# EAGLE design PICqueno32.v1a (EAGLE 5.11)
PROJECT: PICqueño32 v1.0
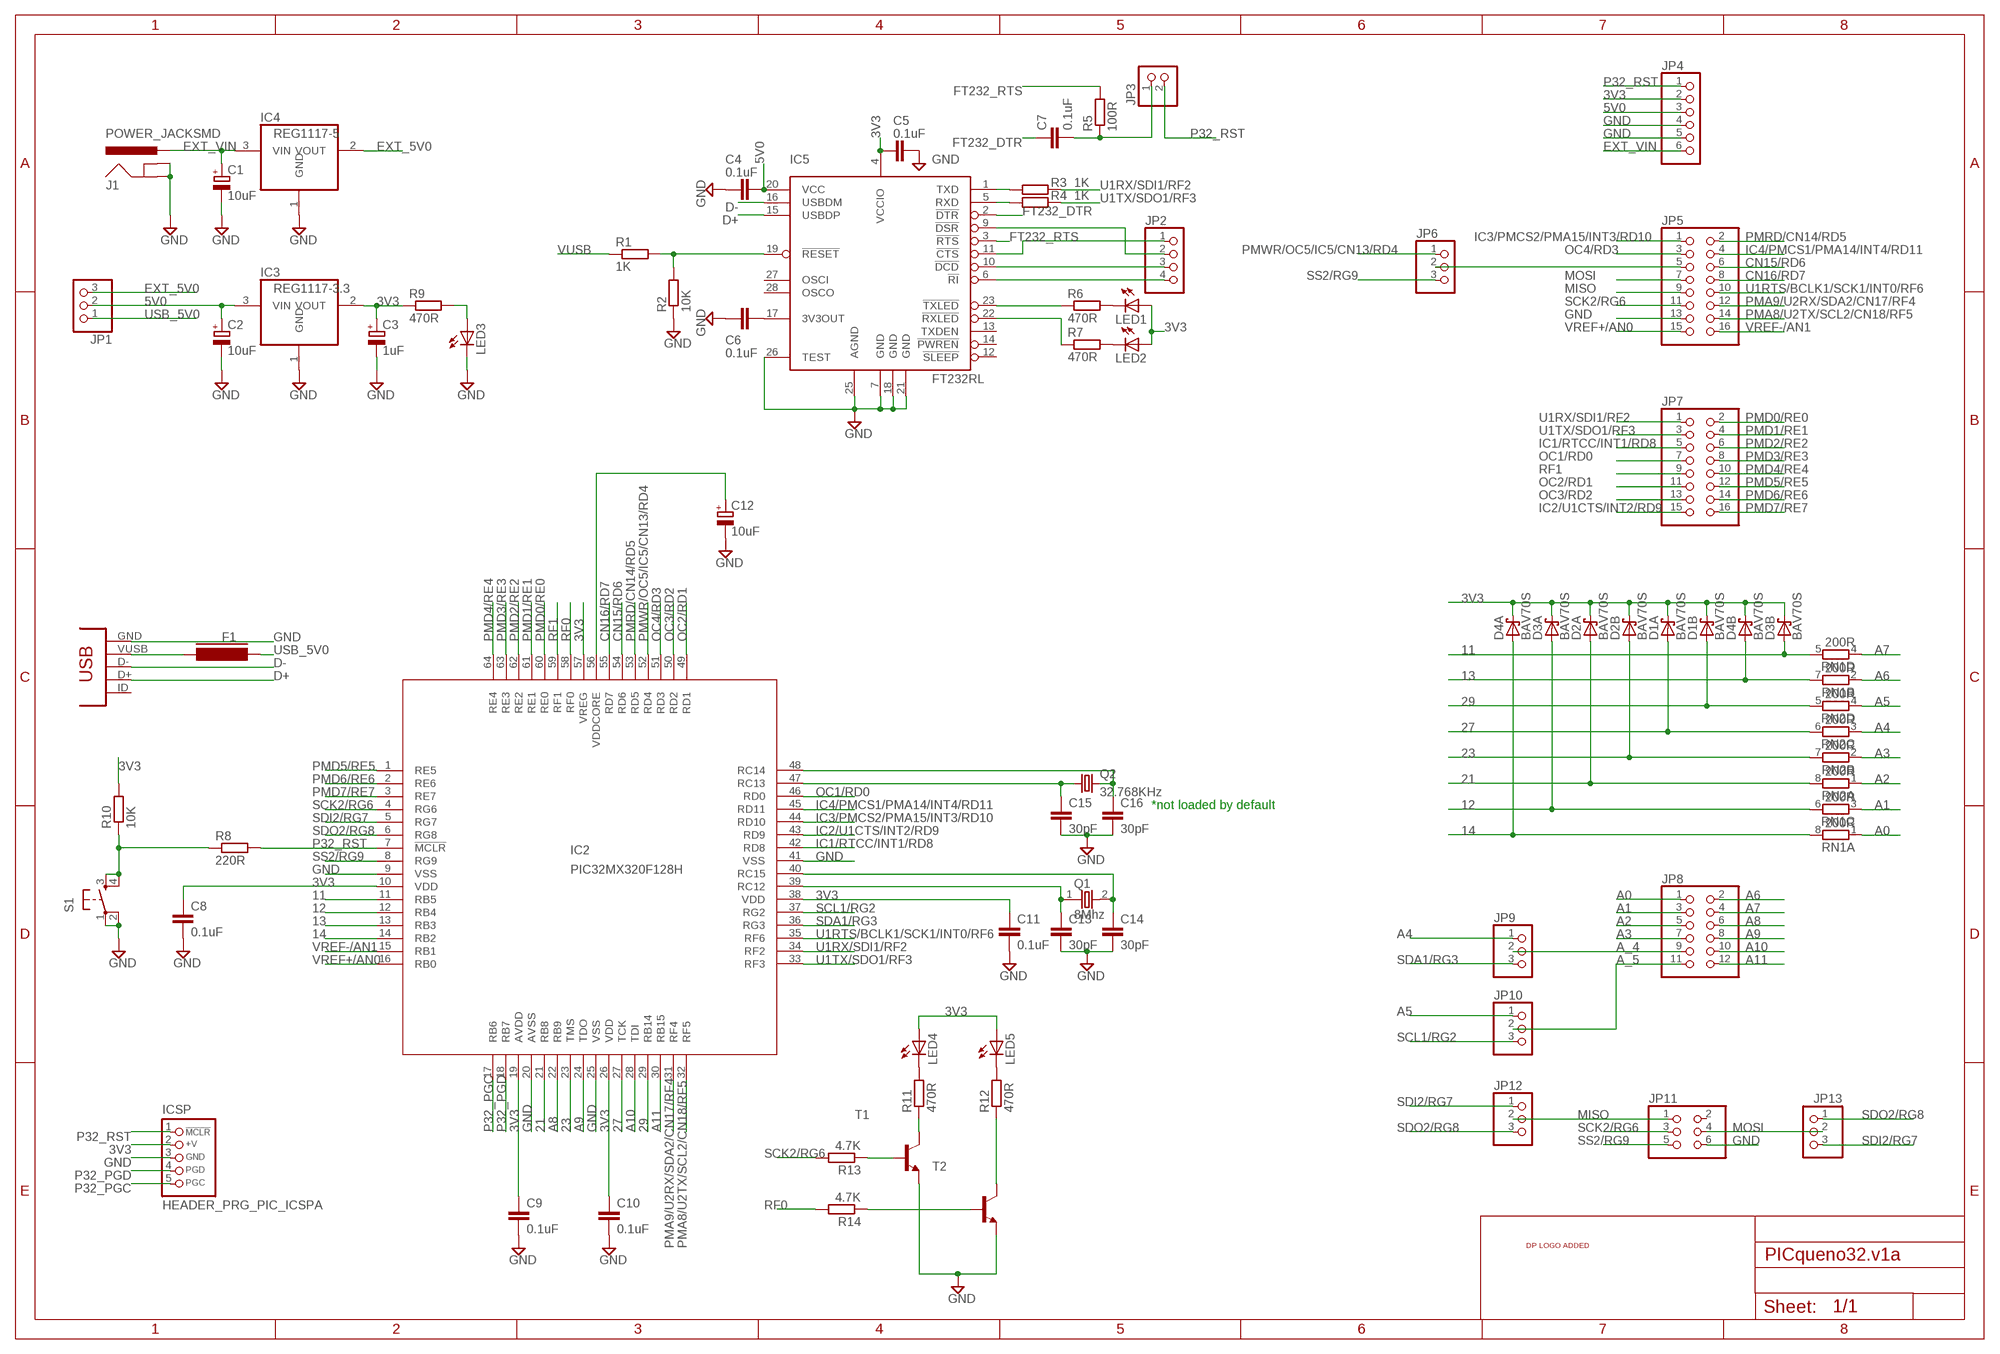
[diagram p0: schematic, sheet 1]

## Parts
C1  10uF  CAP_POLSMC_A  [SMC_A]
C2  10uF  CAP_POLSMC_A  [SMC_A]
C3  1uF  CAP_POLSMC_A  [SMC_A]
C4  0.1uF  CAPC603  [C603]
C5  0.1uF  CAPC603  [C603]
C6  0.1uF  CAPC603  [C603]
C7  0.1uF  CAPC603  [C603]
C8  0.1uF  CAPC603  [C603]
C9  0.1uF  CAPC603  [C603]
C10  0.1uF  CAPC603  [C603]
C11  0.1uF  CAPC603  [C603]
C12  10uF  CAP_POLSMC_A  [SMC_A]
C13  30pF  CAPC603  [C603]
C14  30pF  CAPC603  [C603]
C15  30pF  CAPC603  [C603]
C16  30pF  CAPC603  [C603]
D1  BAV70S  BAS70-07S  [SOT363_PHILIPS]
D2  BAV70S  BAS70-07S  [SOT363_PHILIPS]
D3  BAV70S  BAS70-07S  [SOT363_PHILIPS]
D4  BAV70S  BAS70-07S  [SOT363_PHILIPS]
F1  FERRITE_BEAD603  [FB603]
IC2  PIC32MX320F128H  PIC32MX320F064H  [TQFP64-10X10]
IC3  REG1117-3.3  REG1117  [SOT223]
IC4  REG1117-5  REG1117  [SOT223]
IC5  FT232RL  [SSOP28]
ICSP  HEADER_PRG_PIC_ICSPA  [HEADER_PRG_1X05]
J1  POWER_JACKSMD  [POWER_JACK_SMD]
JP1  PINHD-1X3  [1X03]
JP2  PINHD-1X4  [1X04]
JP3  PINHD-1X2  [1X02]
JP4  PINHD-1X6  [1X06]
JP5  PINHD-2X8  [2X08]
JP6  PINHD-1X3  [1X03]
JP7  PINHD-2X8  [2X08]
JP8  PINHD-2X6  [2X06]
JP9  PINHD-1X3  [1X03]
JP10  PINHD-1X3  [1X03]
JP11  PINHD-2X3  [2X03]
JP12  PINHD-1X3  [1X03]
JP13  PINHD-1X3  [1X03]
LED1  LED805  [LED-805]
LED2  LED805  [LED-805]
LED3  LED805  [LED-805]
LED4  LED805  [LED-805]
LED5  LED805  [LED-805]
Q1  8Mhz  OSC-XTAL  [HC-49U]
Q2  32.768KHz  CRYSTALTC26H  [TC26H]
R1  1K  RESISTORR603  [R603]
R2  10K  RESISTORR603  [R603]
R3  1K  RESISTORR603  [R603]
R4  1K  RESISTORR603  [R603]
R5  100R  RESISTORR603  [R603]
R6  470R  RESISTORR603  [R603]
R7  470R  RESISTORR603  [R603]
R8  220R  RESISTORR603  [R603]
R9  470R  RESISTORR603  [R603]
R10  10K  RESISTORR603  [R603]
R11  470R  RESISTORR603  [R603]
R12  470R  RESISTORR603  [R603]
R13  4.7K  RESISTORR603  [R603]
R14  4.7K  RESISTORR603  [R603]
RN1  200R  RNETWORK  [RN8P-4R-CRA06S]
RN2  200R  RNETWORK  [RN8P-4R-CRA06S]
S1  SW-SMD-SMALL  [TACT_SWITCH_SMALL]
T1  BJT-NPNSOT23BEC  [SOT23-BEC]
T2  BJT-NPNSOT23BEC  [SOT23-BEC]
U$1  DP_LOGO  [DP_LOGO]
USB1  CON-USB-MINI-BUSB1  [CONN_USB_MINI-B]

## Nets
3V3: C3.+ C5.1 C8.1 C9.1 C10.1 C11.1 D1.3(B:C) D1.6(A:C) D2.3(B:C) D2.6(A:C) D3.3(B:C) D3.6(A:C) D4.3(B:C) D4.6(A:C) IC2.10(VDD) IC2.19(AVDD) IC2.26(VDD) IC2.38(VDD) IC2.57(VREG) IC3.2(VOUT) IC5.4(VCCIO) ICSP.2(+V) JP4.2 LED1.A LED2.A LED4.A LED5.A R9.1 R10.2
5V0: C2.+ C4.1 IC3.3(VIN) IC5.20(VCC) JP1.2 JP4.3
11: D3.4(B:A) IC2.11(RB5) RN1.5
12: D3.1(A:A) IC2.12(RB4) RN1.6
13: D4.4(B:A) IC2.13(RB3) RN1.7
14: D4.1(A:A) IC2.14(RB2) RN1.8
21: D2.1(A:A) IC2.21(RB8) RN2.8
23: D2.4(B:A) IC2.23(TMS) RN2.7
27: D1.1(A:A) IC2.27(TCK) RN2.6
29: D1.4(B:A) IC2.29(RB14) RN2.5
A0: JP8.1 RN1.1
A1: JP8.3 RN1.3
A2: JP8.5 RN2.1
A3: JP8.7 RN2.2
A4: JP9.1 RN2.3
A5: JP10.1 RN2.4
A6: JP8.2 RN1.2
A7: JP8.4 RN1.4
A8: IC2.22(RB9) JP8.6
A9: IC2.24(TDO) JP8.8
A10: IC2.28(TDI) JP8.10
A11: IC2.30(RB15) JP8.12
A_4: JP8.9 JP9.2
A_5: JP8.11 JP10.2
CN15/RD6: IC2.54(RD6) JP5.6
CN16/RD7: IC2.55(RD7) JP5.8
CTS: IC5.11(!CTS) JP2.1
D+: IC5.15(USBDP) USB1.D+
D-: IC5.16(USBDM) USB1.D-
DCD: IC5.10(!DCD) JP2.3
DSR: IC5.9(!DSR) JP2.2
EXT_5V0: IC4.2(VOUT) JP1.3
EXT_VIN: C1.+ IC4.3(VIN) J1.VIN0(PWR) JP4.6
FT232_DTR: C7.1 IC5.2(!DTR)
FT232_RTS: IC5.3(!RTS) R5.2
GND: C1.- C2.- C3.- C4.2 C5.2 C6.2 C8.2 C9.2 C10.2 C11.2 C12.- C13.2 C14.2 C15.2 C16.2 IC2.9(VSS) IC2.20(AVSS) IC2.25(VSS) IC2.41(VSS) IC3.1(GND) IC4.1(GND) IC5.7(GND) IC5.18(GND) IC5.21(GND) IC5.25(AGND) IC5.26(TEST) ICSP.3(GND) J1.GND(GNDBREAK) J1.P$4(GND) JP4.4 JP4.5 JP5.13 JP11.6 LED3.C R2.1 S1.1 S1.2 T1.E T2.E USB1.GND
IC1/RTCC/INT1/RD8: IC2.42(RD8) JP7.5
IC2/U1CTS/INT2/RD9: IC2.43(RD9) JP7.15
IC3/PMCS2/PMA15/INT3/RD10: IC2.44(RD10) JP5.1
IC4/PMCS1/PMA14/INT4/RD11: IC2.45(RD11) JP5.4
MISO: JP5.9 JP11.1 JP12.2
MOSI: JP5.7 JP11.4 JP13.2
N$1: C6.1 IC5.17(3V3OUT)
N$2: IC5.19(!RESET) R1.2 R2.2
N$3: IC5.1(TXD) R3.1
N$4: IC5.5(RXD) R4.1
N$5: C12.+ IC2.56(VDDCORE)
N$6: LED1.C R6.2
N$7: C7.2 JP3.1 R5.1
N$8: JP5.5 JP6.2
N$11: LED2.C R7.2
N$12: IC5.23(!TXLED) R6.1
N$15: LED3.A R9.2
N$16: R8.1 R10.1 S1.3 S1.4
N$17: R11.1 T1.C
N$18: LED4.C R11.2
N$19: C13.1 IC2.39(RC12) Q1.1
N$20: C14.1 IC2.40(RC15) Q1.2
N$21: LED5.C R12.2
N$22: C15.1 IC2.47(RC13) Q2.1
N$23: C16.1 IC2.48(RC14) Q2.2
N$24: R12.1 T2.C
N$26: R13.1 T1.B
N$27: R14.1 T2.B
N$32: IC5.22(!RXLED) R7.1
OC1/RD0: IC2.46(RD0) JP7.7
OC2/RD1: IC2.49(RD1) JP7.11
OC3/RD2: IC2.50(RD2) JP7.13
OC4/RD3: IC2.51(RD3) JP5.3
P32_PGC: IC2.17(RB6) ICSP.5(PGC)
P32_PGD: IC2.18(RB7) ICSP.4(PGD)
P32_RST: IC2.7(!MCLR) ICSP.1(/MCLR) JP3.2 JP4.1 R8.2
PMA8/U2TX/SCL2/CN18/RF5: IC2.32(RF5) JP5.14
PMA9/U2RX/SDA2/CN17/RF4: IC2.31(RF4) JP5.12
PMD0/RE0: IC2.60(RE0) JP7.2
PMD1/RE1: IC2.61(RE1) JP7.4
PMD2/RE2: IC2.62(RE2) JP7.6
PMD3/RE3: IC2.63(RE3) JP7.8
PMD4/RE4: IC2.64(RE4) JP7.10
PMD5/RE5: IC2.1(RE5) JP7.12
PMD6/RE6: IC2.2(RE6) JP7.14
PMD7/RE7: IC2.3(RE7) JP7.16
PMRD/CN14/RD5: IC2.53(RD5) JP5.2
PMWR/OC5/IC5/CN13/RD4: IC2.52(RD4) JP6.1
RF0: IC2.58(RF0) R14.2
RF1: IC2.59(RF1) JP7.9
RI: IC5.6(!RI) JP2.4
SCK2/RG6: IC2.4(RG6) JP5.11 JP11.3 R13.2
SCL1/RG2: IC2.37(RG2) JP10.3
SDA1/RG3: IC2.36(RG3) JP9.3
SDI2/RG7: IC2.5(RG7) JP12.1 JP13.3
SDO2/RG8: IC2.6(RG8) JP12.3 JP13.1
SS2/RG9: IC2.8(RG9) JP6.3 JP11.5
U1RTS/BCLK1/SCK1/INT0/RF6: IC2.35(RF6) JP5.10
U1RX/SDI1/RF2: IC2.34(RF2) JP7.1 R3.2
U1TX/SDO1/RF3: IC2.33(RF3) JP7.3 R4.2
USB_5V0: F1.1 JP1.1
VREF+/AN0: IC2.16(RB0) JP5.15
VREF-/AN1: IC2.15(RB1) JP5.16
VUSB: F1.2 R1.1 USB1.VUSB
Unconnected: IC5.12(!SLEEP) IC5.13(TXDEN) IC5.14(!PWREN) IC5.27(OSCI) IC5.28(OSCO) JP11.2 USB1.BODY@1(BODY) USB1.BODY@2(BODY) USB1.BODY@3(BODY) USB1.BODY@4(BODY) USB1.ID(USBID)

## Notes on the sheet
- *not loaded by default

## Library data of the parts
C1-C3 C12 = dp_devices:CAP_POL
C4-C11 C13-C16 = dp_devices:CAP
D1-D4 = diode:BAS70-07: Silicon Schottky Diodes General-purpose diode for high-speed switching Source: BAS70_1PS7XSB70_SER_8.pdf
F1 = dp_devices:FERRITE_BEAD
IC2 = microchip:PIC32MX320F*H: PIC32MX320FxxxH Source: http://ww1.microchip.com/downloads/en/DeviceDoc/61143E.pdf, PIC32MX320F064H.bsdl; MPN: PIC32MX320F064H-80I/PT; OC_FARNELL: 1778934; OC_NEWARK: 77M3147
IC3 IC4 = burr-brown:REG1117: 800mA and 1A Low Dropout (LDO) Positive Regulator 1.8V, 2.5V, 2.85V, 3.3V, 5V, and Adj; MPN: REG1117; OC_FARNELL: 1097566; OC_NEWARK: 14P6981
IC5 = dp_devices:FT232RL: USB to serial UART interface
ICSP = dp_devices:HEADER_PRG_PIC_ICSP: 5-pin PIC In Circuit Serial Programming header
J1 = SparkFun:POWER_JACK: Power Jack This is the standard 5.5mm barrel jack for power. The PTH is the most common, proven, reliable, footprint. All others are experimental. The Slot footprint only works if the mill layer is transmitted to the PCB fab house so be warned. Spark Fun Electronics SKU : PRT-00119. Mating wall wart : TOL-00298 (and others)
JP1 JP6 JP9 JP10 JP12 JP13 = pinhead:PINHD-1X3: PIN HEADER
JP2 = pinhead:PINHD-1X4: PIN HEADER
JP3 = pinhead:PINHD-1X2: PIN HEADER
JP4 = pinhead:PINHD-1X6: PIN HEADER
JP5 JP7 = pinhead:PINHD-2X8: PIN HEADER
JP8 = pinhead:PINHD-2X6: PIN HEADER
JP11 = pinhead:PINHD-2X3: PIN HEADER
LED1-LED5 = dp_devices:LED
Q1 = dp_devices:OSC-XTAL
Q2 = crystal:CRYSTAL: CRYSTAL; OC_FARNELL: unknown; OC_NEWARK: unknown
R1-R14 = dp_devices:RESISTOR
RN1 RN2 = dp_devices:RNETWORK: 4 Resistor Array 0603
S1 = dp_devices:SW-SMD-SMALL
T1 T2 = dp_devices:BJT-NPN: Most commonly used is SOT23-BEC
U$1 = dp_devices:DP_LOGO; FF1: fullfillment by; FF2: Seeed studio; FF3: www.seeedstudio.com; LICENSE: CC-BY-SA; PROJECT: project; URL1: DangerousPrototypes.com; URL2: DangerousPrototypes.com
USB1 = dp_devices:CON-USB-MINI-B: USB connector

## Board
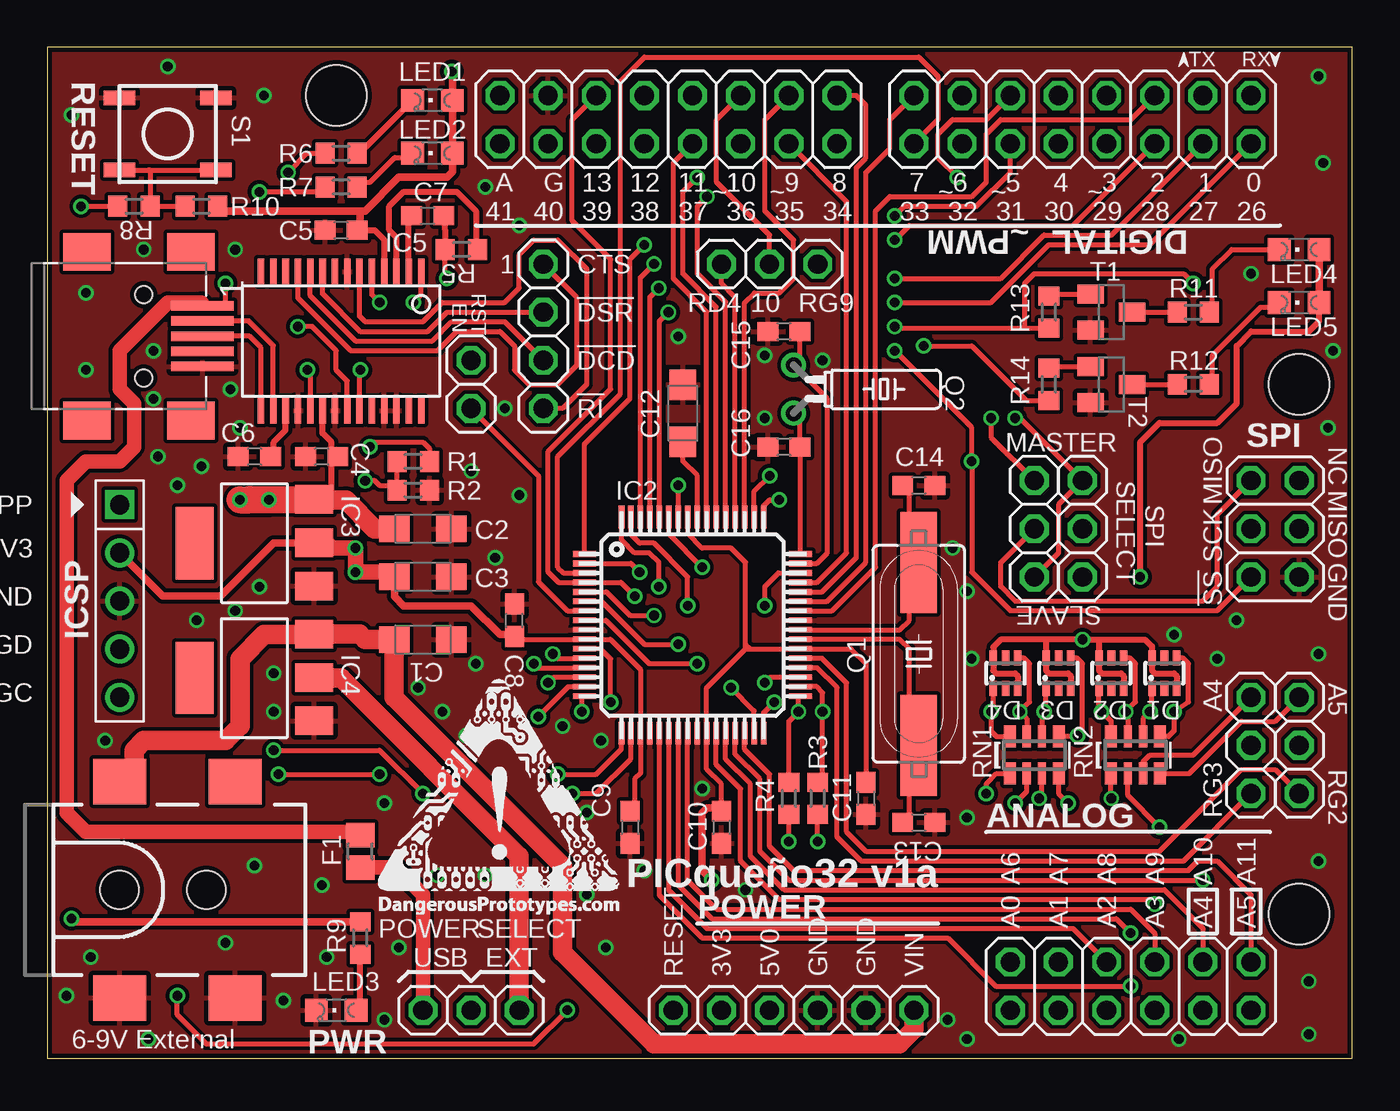
[diagram p1: board, top side]
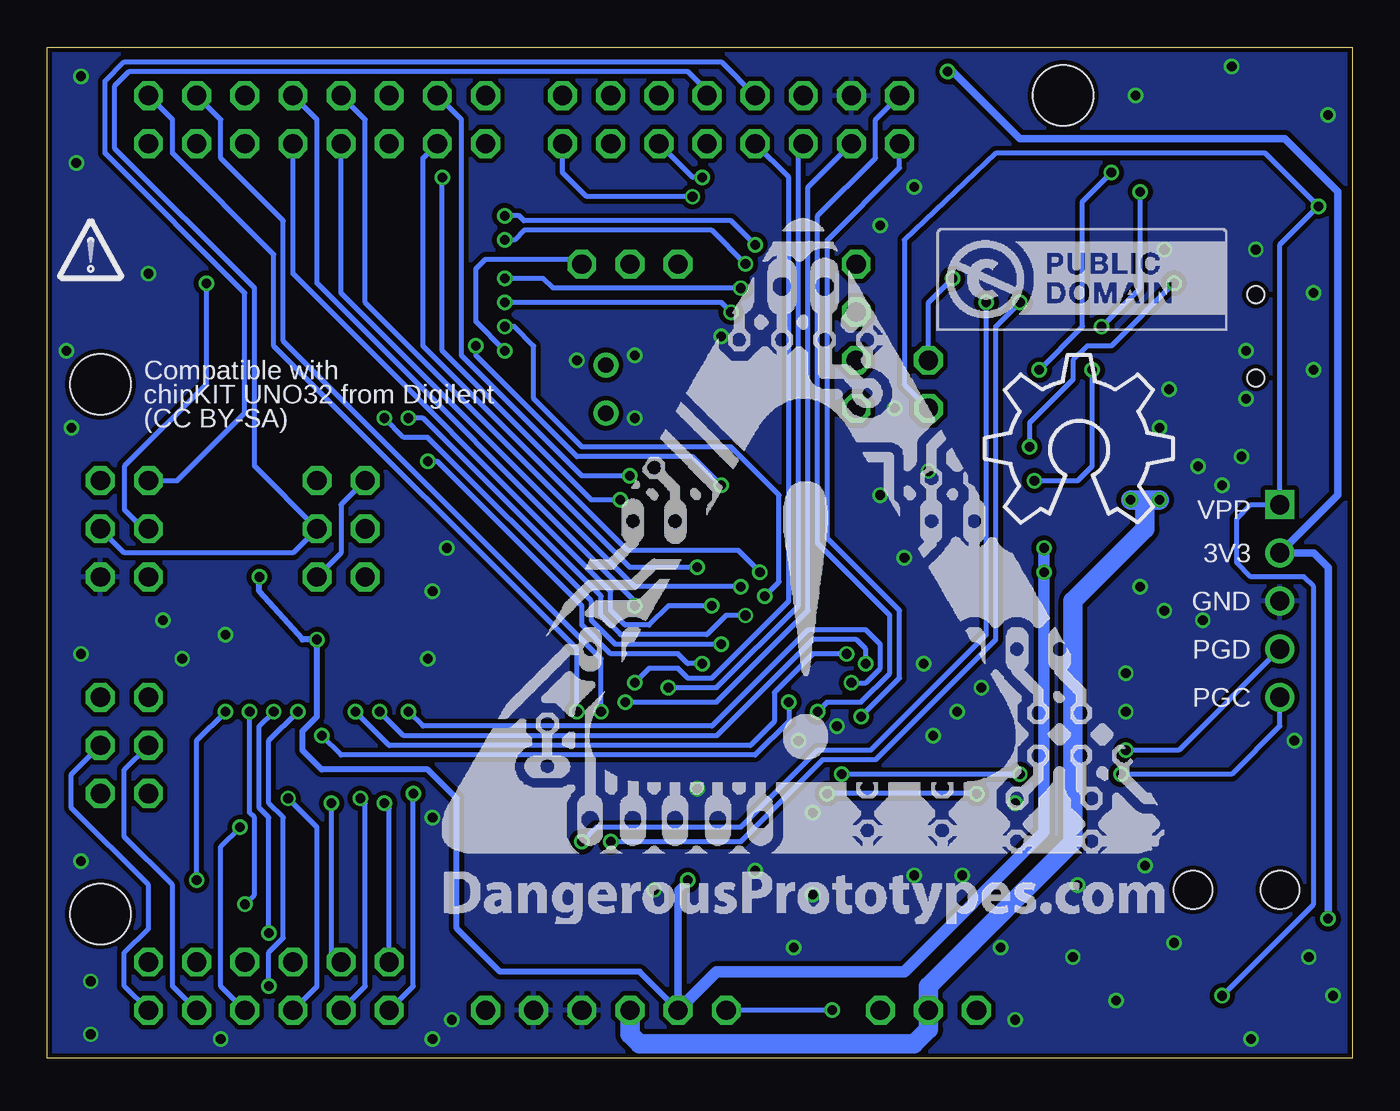
[diagram p2: board, bottom side, seen from below]

Size 68.83 x 53.34 mm. Coordinates in mm from the lower left corner, seen from the top.
Outline: 0,0 68.83,0 68.83,53.34 0,53.34 0,0
Copper layers (1*16): Top 0.035mm / dielectric 1.5mm / Bottom 0.035mm
Design rules "Fusion_eagle_rule_v1.1": minimum track width 6mil, minimum drill 12mil, track to track 6mil, track to pad 6mil, pad to pad 6mil, via to via 6mil, smd to smd 0mil, copper to edge 10mil, drill to drill 10mil, minimum pad ring 10mil, minimum via ring 6mil, stop-mask expansion 2mil, vias tented up to drill 100mil, thermal gap 10mil
Holes 3.2 mm at 66.04,35.56 66.04,7.62 15.24,50.8

### Footprints (pad centres in the part's own frame; a part is rotated, then mirrored left to right if it is on the bottom)
SMC_A = smd 1.6 x 1.4: + -1.5,0; - 1.5,0
C603 = smd 1.1 x 1: 1 -0.85,0; 2 0.85,0
SOT363_PHILIPS = smd 0.4 x 0.8: 1 -0.65,-0.8; 2 0,-0.8; 3 0.65,-0.8; 4 0.65,0.8; 5 0,0.8; 6 -0.65,0.8
FB603 = smd 1.3 x 1.5: 1 -0.85,0; 2 0.85,0
TQFP64-10X10 = smd 1.2 x 0.3: 1 -5.7,3.75; 2 -5.7,3.25; 3 -5.7,2.75; 4 -5.7,2.25; 5 -5.7,1.75; 6 -5.7,1.25; 7 -5.7,0.75; 8 -5.7,0.25; 9 -5.7,-0.25; 10 -5.7,-0.75; 11 -5.7,-1.25; 12 -5.7,-1.75; 13 -5.7,-2.25; 14 -5.7,-2.75; 15 -5.7,-3.25; 16 -5.7,-3.75; 33 5.7,-3.75; 34 5.7,-3.25; 35 5.7,-2.75; 36 5.7,-2.25; 37 5.7,-1.75; 38 5.7,-1.25; 39 5.7,-0.75; 40 5.7,-0.25; 41 5.7,0.25; 42 5.7,0.75; 43 5.7,1.25; 44 5.7,1.75; 45 5.7,2.25; 46 5.7,2.75; 47 5.7,3.25; 48 5.7,3.75 | smd 0.3 x 1.2: 17 -3.75,-5.7; 18 -3.25,-5.7; 19 -2.75,-5.7; 20 -2.25,-5.7; 21 -1.75,-5.7; 22 -1.25,-5.7; 23 -0.75,-5.7; 24 -0.25,-5.7; 25 0.25,-5.7; 26 0.75,-5.7; 27 1.25,-5.7; 28 1.75,-5.7; 29 2.25,-5.7; 30 2.75,-5.7; 31 3.25,-5.7; 32 3.75,-5.7; 49 3.75,5.7; 50 3.25,5.7; 51 2.75,5.7; 52 2.25,5.7; 53 1.75,5.7; 54 1.25,5.7; 55 0.75,5.7; 56 0.25,5.7; 57 -0.25,5.7; 58 -0.75,5.7; 59 -1.25,5.7; 60 -1.75,5.7; 61 -2.25,5.7; 62 -2.75,5.7; 63 -3.25,5.7; 64 -3.75,5.7
SOT223 = smd 1.499 x 2.007: 1 -2.261,-3.15; 2 0.025,-3.15; 3 2.311,-3.15 | smd 3.81 x 2.007: 4 0,3.15
SSOP28 = smd 0.348 x 1.397: 1 -4.225,-3.656; 2 -3.575,-3.656; 3 -2.925,-3.656; 4 -2.275,-3.656; 5 -1.625,-3.656; 6 -0.975,-3.656; 7 -0.325,-3.656; 8 0.325,-3.656; 9 0.975,-3.656; 10 1.625,-3.656; 11 2.275,-3.656; 12 2.925,-3.656; 13 3.575,-3.656; 14 4.225,-3.656; 15 4.225,3.656; 16 3.575,3.656; 17 2.925,3.656; 18 2.275,3.656; 19 1.625,3.656; 20 0.975,3.656; 21 0.325,3.656; 22 -0.325,3.656; 23 -0.975,3.656; 24 -1.625,3.656; 25 -2.275,3.656; 26 -2.925,3.656; 27 -3.575,3.656; 28 -4.225,3.656
HEADER_PRG_1X05 = drill 1.016 square: 1 -5.08,0 | drill 1.016 round: 2 -2.54,0; 3 0,0; 4 2.54,0; 5 5.08,0
POWER_JACK_SMD = smd 2.8 x 2.4: GND 0,-5.7; P$4 6.1,-5.7; VIN0 0,5.7; VIN1 6.1,5.7 | hole 2.032: 0,0; 4.572,0
1X03 = drill 1.016 octagon: 1 -2.54,0; 2 0,0; 3 2.54,0
1X04 = drill 1.016 octagon: 1 -3.81,0; 2 -1.27,0; 3 1.27,0; 4 3.81,0
1X02 = drill 1.016 octagon: 1 -1.27,0; 2 1.27,0
1X06 = drill 1.016 octagon: 1 -6.35,0; 2 -3.81,0; 3 -1.27,0; 4 1.27,0; 5 3.81,0; 6 6.35,0
2X08 = drill 1.016 octagon: 1 -8.89,-1.27; 2 -8.89,1.27; 3 -6.35,-1.27; 4 -6.35,1.27; 5 -3.81,-1.27; 6 -3.81,1.27; 7 -1.27,-1.27; 8 -1.27,1.27; 9 1.27,-1.27; 10 1.27,1.27; 11 3.81,-1.27; 12 3.81,1.27; 13 6.35,-1.27; 14 6.35,1.27; 15 8.89,-1.27; 16 8.89,1.27
2X06 = drill 1.016 octagon: 1 -6.35,-1.27; 2 -6.35,1.27; 3 -3.81,-1.27; 4 -3.81,1.27; 5 -1.27,-1.27; 6 -1.27,1.27; 7 1.27,-1.27; 8 1.27,1.27; 9 3.81,-1.27; 10 3.81,1.27; 11 6.35,-1.27; 12 6.35,1.27
2X03 = drill 1.016 octagon: 1 -2.54,-1.27; 2 -2.54,1.27; 3 0,-1.27; 4 0,1.27; 5 2.54,-1.27; 6 2.54,1.27
LED-805 = smd 1.2 x 1.2: A 0,-1.05; C 0,1.05
HC-49U = smd 5.334 x 1.93: 1 -4.826,0; 2 4.826,0
TC26H = drill 0.813 round: 1 -1.27,0; 2 1.27,0
R603 = smd 1 x 1.1: 1 -0.85,0; 2 0.85,0
RN8P-4R-CRA06S = smd 0.63 x 1.15: 1 -1.295,-0.975; 4 1.295,-0.975; 5 1.295,0.975; 8 -1.295,0.975 | smd 0.44 x 1.15: 2 -0.4,-0.975; 3 0.4,-0.975; 6 0.4,0.975; 7 -0.4,0.975
TACT_SWITCH_SMALL = smd 1.651 x 0.762: 1 -2.54,1.905; 2 2.54,1.905; 3 -2.54,-1.905; 4 2.54,-1.905
SOT23-BEC = smd 1 x 1.4: B -0.95,-1.1; C 0,1.1; E 0.95,-1.1
CONN_USB_MINI-B = smd 2 x 2.5: BODY@1 -4.45,2.5; BODY@2 4.45,2.5; BODY@3 4.45,-3; BODY@4 -4.45,-3 | smd 0.5 x 3.3: D+ 0,3.1; D- -0.8,3.1; GND 1.6,3.1; ID 0.8,3.1; VUSB -1.6,3.1 | hole 0.9: -2.2,0; 2.2,0

### Placement (x,y rotation side)
C1  19.81,22.1 0 top
C2  19.81,27.94 0 top
C3  19.81,25.4 0 top
C4  14.48,31.75 180 top
C5  15.49,43.69 180 top
C6  10.92,31.75 180 top
C7  20.07,44.45 0 top
C8  24.64,23.11 90 top
C9  30.73,12.19 270 top
C10  35.56,12.19 270 top
C11  43.18,13.72 270 top
C12  33.53,34.04 90 top
C13  45.97,12.45 0 top
C14  45.97,30.23 0 top
C15  38.86,38.35 180 top
C16  38.86,32.26 180 top
D1  58.93,20.32 0 top
D2  56.13,20.32 0 top
D3  53.34,20.32 0 top
D4  50.55,20.32 0 top
F1  16.51,10.92 90 top
IC2  34.04,22.86 0 top
IC3  10.92,27.18 90 top
IC4  10.92,20.07 90 top
IC5  15.49,37.85 180 top
ICSP  3.81,24.13 270 top
J1  3.81,8.89 0 top
JP1  22.35,2.54 0 top
JP2  26.16,38.1 270 top
JP3  22.35,35.56 270 top
JP4  39.37,2.54 0 top
JP5  32.77,49.53 180 top
JP6  38.1,41.91 0 top
JP7  54.61,49.53 180 top
JP8  57.15,3.81 0 top
JP9  63.5,16.51 270 top
JP10  66.04,16.51 270 top
JP11  64.77,27.94 270 top
JP12  52.07,27.94 270 top
JP13  54.61,27.94 270 top
LED1  20.32,50.55 90 top
LED2  20.32,47.75 90 top
LED3  15.24,2.54 90 top
LED4  66.04,42.67 90 top
LED5  66.04,39.88 90 top
LOGO1  LOGO_CC-0  [LOGO_CC-0]  21.91,38.42 0 bottom
Q1  45.97,21.34 90 top
Q2  39.37,35.31 270 top
R1  19.3,31.5 180 top
R2  19.3,29.97 180 top
R3  40.64,13.72 90 top
R4  39.12,13.72 90 top
R5  21.84,42.67 0 top
R6  15.49,47.75 0 top
R7  15.49,45.97 0 top
R8  4.57,44.96 180 top
R9  16.51,6.35 270 top
R10  8.13,44.96 0 top
R11  60.45,39.37 0 top
R12  60.45,35.56 0 top
R13  52.83,39.37 270 top
R14  52.83,35.56 270 top
RN1  52.07,16 0 top
RN2  57.4,16 0 top
S1  6.35,48.77 0 top
T1  56.13,39.37 270 top
T2  56.13,35.56 270 top
U$1  66.55,41.66 0 bottom
U$3  [DP_LOGO_ART_1.5X1.5]  48.01,7.11 0 bottom
U$4  [DP_LOGO_ART_0.5X0.5]  17.46,7.62 0 top
U$6  [OSHW_8X350_NOTEXT]  19.37,28.26 0 bottom
USB1  5.08,38.1 270 top

### Tracks (layer width: path | path; a pad name or v marks a point on that pad's centre or on a via)
3V3  (via drill 0.51)
  Top 0.254: C8.1 24.99,22.11 IC2.10 29.71,22.11 31.29,20.53 IC2.19 31.29,15.03 30.99,14.73 30.99,13.3 C9.1 | C5.1 16.26,43.78 | C10.1 35.56,14.48 34.79,15.25 IC2.26 34.79,19.55 36.83,21.59 | IC2.57 33.79,27.68 34.54,26.92 36.07,26.92 36.83,26.16 36.83,21.84 | 36.83,21.59 36.83,21.84 | 36.83,21.59 37.08,21.59 | 36.83,21.84 37.08,21.59 | C11.1 43.18,20.83 42.4,21.61 IC2.38 39.21,21.61 39.19,21.59 37.08,21.59
  Top 0.305: IC5.4 17.77,43.19 17.27,43.69 C5.1 | LED5.A 67.09,38.9 66.55,38.35 63.5,38.35 62.74,37.59 62.74,34.54 61.72,33.53 58.67,33.53 57.66,32.51 v57.66,25.4 | D4.3 51.2,20.18 51.05,20.32 50.04,20.32 49.9,20.46 D4.6 49.9,21.7 50.29,22.1 52.69,22.1 | D3.3 53.99,20.18 53.85,20.32 52.83,20.32 52.69,20.46 D3.6 52.69,22.1 | D2.3 56.78,20.18 56.64,20.32 55.63,20.32 55.48,20.46 D2.6 55.48,22.1 | D1.3 59.58,20.18 59.44,20.32 58.42,20.32 58.28,20.46 D1.6 58.28,21.73 57.91,22.1 55.48,22.1 | 55.48,22.1 v54.61,22.1 52.69,22.1
  Top 0.406: LED5.A LED4.A | C5.1 16.51,43.85 16.51,44.7 | 16.51,44.7 16.76,44.7 18.54,46.48 21.08,46.48 21.37,46.77 LED2.A LED1.A 21.37,52.04 v21.34,52.07 | ICSP.2 6.1,24.38 9.14,24.38 11.94,27.18 14.05,27.18 IC3.2 | C3.+ 18.31,24.36 18.8,23.88 22.35,23.88 23.88,22.35 24.55,22.35 C8.1 | v35.05,9.4 34.54,9.91 34.54,12.95 34.8,13.21 35.47,13.21 C10.1 | R9.1 1.44,7.2 v1.27,7.37 | 16.51,44.7 9.23,44.7 R10.2
  Top 0.813: IC3.2 14.71,27.2 14.99,26.92 v16.26,26.92 v16.26,25.65 18.06,25.65 C3.+
  Bottom 0.305: JP4.2 37.59,4.57 44.96,4.57 47.24,6.86 47.24,13.72 48.77,15.24 54.36,15.24 55.37,16.26 55.37,17.27 54.61,18.03 v54.61,22.1 55.37,22.1 57.66,24.64 v57.66,25.4
  Bottom 0.406: JP4.2 35.56,8.89 v35.05,9.4 | v21.34,52.07 21.08,52.07 17.53,48.51 3.56,48.51 0.76,45.72 0.76,29.72 ICSP.2 2.03,26.67 1.27,25.91 v1.27,7.37
  Bottom 0.61: v16.26,26.92 16.26,11.94 23.62,4.57 33.53,4.57 JP4.2
5V0  (via drill 0.51)
  Top 0.305: IC5.20 14.52,32.98 14.99,32.51 14.99,32.09 C4.1 14.99,31.75 14.99,29.72 14.73,29.46
  Top 1.016: 14.55,29.46 IC3.3 14.1,29.46 14.73,29.46 15.75,29.46 17.27,27.94 C2.+
  Top 1.422: v11.68,29.46 10.67,29.46 | v10.16,29.46 10.67,29.46 | IC3.3 10.69,29.49 10.67,29.46
  Bottom 1.016: JP4.3 38.1,1.27 37.59,0.76 23.11,0.76 22.35,1.52 JP1.2 22.35,3.81 14.73,11.43 14.73,24.13 10.92,27.94 10.92,29.46 | 10.92,29.46 v10.16,29.46 | 10.92,29.46 v11.68,29.46
11  (via drill 0.51)
  Top 0.254: D3.4 54.32,21.12 54.61,20.83 54.61,17.27 v54.36,17.02 54.31,16.98 RN1.5 | IC2.11 29.19,21.61 29.72,21.08 v29.72,18.8
  Bottom 0.254: 54.1,17.02 v54.36,17.02 53.34,16 31.5,16 29.72,17.78 v29.72,18.8
12  (via drill 0.51)
  Top 0.254: IC2.12 26.9,21.11 v26.67,21.34 | D3.1 52.69,18.4 v52.58,18.29 52.47,18.18 RN1.6
  Bottom 0.254: v26.67,21.34 28.45,21.34 30.48,19.3 30.48,17.78 31.75,16.51 50.8,16.51 v52.58,18.29
13  (via drill 0.51)
  Top 0.254: D4.4 51.52,21.12 51.82,20.83 51.82,18.8 v51.31,18.29 51.67,17.93 RN1.7 | IC2.13 25.87,20.61 v25.65,20.83
  Bottom 0.254: v25.65,20.83 25.65,21.59 26.16,22.1 28.45,22.1 33.53,17.02 50.04,17.02 v51.31,18.29
14  (via drill 0.51)
  Top 0.254: IC2.14 26.71,20.11 v26.42,19.81 | RN1.8 50.08,16.98 49.78,17.27 v49.78,18.29 49.9,18.4 D4.1
  Bottom 0.254: v26.42,19.81 25.65,19.81 24.89,20.57 24.89,21.84 25.65,22.61 28.7,22.61 33.78,17.53 49.02,17.53 v49.78,18.29
21  (via drill 0.51)
  Top 0.254: IC2.21 32.29,8.61 34.54,6.35 47.5,6.35 50.04,3.81 v57.15,3.81 | D2.1 55.48,18.43 v55.63,18.29 56.11,17.8 RN2.8
  Bottom 0.254: v57.15,3.81 57.15,5.59 56.39,6.35 56.39,12.7 57.15,13.46 57.15,16.76 v55.63,18.29
23  (via drill 0.51)
  Top 0.254: D2.4 57.11,21.12 57.4,20.83 57.4,18.8 v56.9,18.29 57,18.18 RN2.7 | IC2.23 33.29,9.13 35.05,7.37 56.39,7.37 v57.15,6.6
  Bottom 0.254: 57.15,18.03 v56.9,18.29 57.66,17.53 57.66,13.21 57.15,12.7 v57.15,6.6
27  (via drill 0.51)
  Top 0.254: D1.1 58.28,18.4 v58.17,18.29 57.8,17.93 RN2.6 | IC2.27 35.29,15.51 36.58,14.22 36.58,10.41 38.61,8.38 58.17,8.38 v58.42,8.13
  Bottom 0.254: v58.42,8.13 57.91,8.64 57.91,12.7 58.17,12.95 v58.17,18.29
29  (via drill 0.51)
  Top 0.254: D1.4 59.91,21.12 60.2,20.83 60.2,18.8 v59.44,18.29 59.44,17.27 59.14,16.98 RN2.5 | IC2.29 36.29,16.04 37.59,14.73 37.59,10.92 39.12,9.4 v60.96,9.4
  Bottom 0.254: v60.96,9.4 60.96,16.76 v59.44,18.29
A0  (via drill 0.51)
  Top 0.254: RN1.1 50.08,15.03 49.53,14.48 v49.53,13.97
  Bottom 0.254: v49.53,13.97 49.53,3.81 JP8.1
A1  (via drill 0.51)
  Top 0.254: RN1.3 52.47,13.86 v52.32,13.72
  Bottom 0.254: v52.32,13.72 52.07,13.46 52.07,3.81 JP8.3
A2  (via drill 0.51)
  Top 0.254: RN2.1 56.11,13.74 v56.13,13.72
  Bottom 0.254: v56.13,13.72 54.61,12.19 54.61,3.81 JP8.5
A3  (via drill 0.51)
  Top 0.254: RN2.2 57,13.86 v58.67,12.19
  Bottom 0.254: v58.67,12.19 59.69,11.18 59.69,3.81 JP8.7
A4
  Top 0.254: RN2.3 57.8,15.64 58.17,16 60.45,16 JP9.1
A5
  Top 0.254: RN2.4 60.24,15.03 62.99,17.78 64.77,17.78 JP10.1
A6  (via drill 0.51)
  Top 0.254: RN1.2 51.67,14.08 v51.05,13.46
  Bottom 0.254: v51.05,13.46 50.8,13.21 JP8.2
A7  (via drill 0.51)
  Top 0.254: RN1.4 53.37,13.95 v53.85,13.46
  Bottom 0.254: v53.85,13.46 53.85,5.59 JP8.4
A8
  Top 0.254: JP8.6 54.1,6.86 34.8,6.86 32.79,8.87 IC2.22
A9
  Top 0.254: IC2.24 33.78,9.4 35.31,7.87 57.15,7.87 58.42,6.6 JP8.8
A10
  Top 0.254: IC2.28 35.79,15.78 37.08,14.48 37.08,10.67 38.86,8.89 58.93,8.89 60.96,6.86 JP8.10
A11
  Top 0.254: IC2.30 36.79,16.3 38.1,14.99 38.1,11.18 39.37,9.91 60.2,9.91 60.71,10.41 61.72,10.41 63.5,8.64 JP8.12
A_4
  Bottom 0.254: JP8.9 62.23,3.81 62.23,9.14 64.77,11.68 64.77,15.24 JP9.2
A_5
  Bottom 0.254: JP10.2 67.56,14.99 67.56,13.21 63.5,9.14 63.5,6.86 64.77,5.59 64.77,3.81 JP8.11
CN15/RD6  (via drill 0.51)
  Top 0.254: v34.29,46.48 33.53,45.72 33.53,41.4 35.29,39.64 IC2.54
  Bottom 0.254: v34.29,46.48 34.8,46.48 JP5.6
CN16/RD7
  Top 0.254: JP5.8 33.02,47.24 33.02,41.15 34.79,39.38 IC2.55
CTS
  Top 0.254: JP2.1 27.94,40.13 27.94,36.58 26.92,35.56 25.4,35.56 24.64,36.32 24.64,37.59 23.88,38.35 21.59,38.35 20.57,37.34 16,37.34 13.22,40.12 IC5.11
D+
  Top 0.254: USB1.D+ 10.67,38.1 11.27,37.5 IC5.15
D-
  Top 0.254: IC5.16 11.92,37.61 10.63,38.9 USB1.D-
DCD
  Top 0.254: JP2.3 24.13,38.86 21.34,38.86 20.32,37.85 16.26,37.85 13.87,40.23 IC5.10
DSR
  Top 0.254: IC5.9 14.52,40.34 16.51,38.35 20.07,38.35 21.08,39.37 JP2.2
EXT_5V0
  Top 1.016: JP1.3 24.89,10.67 15.49,20.07 14.61,20.07 IC4.2
EXT_VIN
  Top 1.016: J1.VIN0 3.92,14.59 4.57,15.24 4.57,16.26 5.08,16.76 9.4,16.76 10.16,17.53 10.16,21.08 11.43,22.35 14.55,22.35 IC4.3 16.48,22.38 16.76,22.1 C1.+ 18.29,22.07 18.29,19.05 27.18,10.16 27.18,5.59 32,0.76 44.96,0.76 45.72,1.52 JP4.6
FT232_DTR
  Top 0.305: IC5.2 19.07,44.3 C7.1
FT232_RTS
  Top 0.305: IC5.3 18.42,43.3 18.03,43.69 18.03,44.96 18.8,45.72 21.59,45.72 22.61,44.7 22.61,42.76 R5.2
GND  (via drill 0.51)
  other vias: 40.89,36.83 33.27,38.1 9.65,35.31 5.84,31.75 8.13,31.24 5.59,37.34 5.08,42.67 9.91,42.67 2.03,40.39 2.03,36.32 36.83,8.89 31.5,9.91 1.27,49.78 11.43,50.8 6.35,52.32 67.06,51.82 63.5,41.4 67.82,37.34 67.31,47.24 67.56,33.27 67.06,21.34 66.55,4.06 67.06,10.41 66.55,1.27 48.51,1.02 59.69,1.02 5.33,1.02 1.02,3.3 2.29,5.33 9.4,6.1 12.45,3.05 14.73,5.33 10.92,10.16 14.48,9.14 18.54,5.84 17.78,2.03 11.94,20.32 9.91,23.62 7.87,23.11 11.18,24.89 3.05,16.76 19.56,19.56 20.83,18.29 23.62,26.42 24.89,29.72 22.35,30.99 24.13,34.29 6.86,30.23 5.59,34.8 10.16,33.27 23.11,45.97 24.89,43.94 11.94,18.29 48.51,12.7 48.51,24.64 47.75,26.92 28.45,12.95 34.54,14.22 59.44,22.35 61.72,21.08 48.77,21.08 62.74,23.11 28.45,8.64 29.46,5.84 22.1,17.02 17.78,13.46 23.11,9.65 20.57,9.65 47.5,2.03 27.18,17.53 29.21,16.76 22.61,20.83 37.85,33.78 37.85,37.08
  pour Top (isolate 0.203): 0,0 68.83,0 68.83,53.34 0,53.34
  pour Bottom (isolate 0.254): 0,0 68.83,0 68.83,53.34 0,53.34
IC1/RTCC/INT1/RD8
  Top 0.254: IC2.42 41.39,23.61 43.69,25.91 43.69,44.7 44.45,45.47 48.77,45.47 49.53,46.23 49.53,48.77 50.29,49.53 57.15,49.53 JP7.5
IC2/U1CTS/INT2/RD9
  Top 0.254: IC2.43 41.13,24.11 43.18,26.16 43.18,46.74 44.45,48.01 44.45,49.53 JP7.15
IC3/PMCS2/PMA15/INT3/RD10
  Top 0.254: IC2.44 40.87,24.61 42.67,26.42 42.67,46.99 43.18,47.5 43.18,50.29 42.67,50.8 JP5.1
IC4/PMCS1/PMA14/INT4/RD11
  Top 0.254: IC2.45 40.6,25.11 42.16,26.67 42.16,44.2 42.16,44.7 42.16,45.21 JP5.4
MISO
  Top 0.254: JP12.2 50.29,26.16 50.29,24.89 51.05,24.13 60.96,24.13 61.72,24.89 61.72,28.7 JP11.1
  Bottom 0.254: JP5.9 33.27,52.58 64.77,52.58 65.79,51.56 65.79,47.75 58.42,40.39 58.42,34.04 61.98,30.48 JP11.1
MOSI
  Bottom 0.254: JP5.7 34.04,51.05 35.05,52.07 64.52,52.07 65.28,51.31 65.28,48.01 57.91,40.64 57.91,31.24 JP13.2 55.88,26.67 64.77,26.67 JP11.4
N$1
  Top 0.305: IC5.17 12.57,33.14 11.94,32.51 11.94,31.92 C6.1
N$2  (via drill 0.51)
  Top 0.254: R1.2 R2.2 18.2,30.23 17.53,30.23 17.27,30.48 v16.76,30.48 | IC5.19 13.87,36.17 v13.72,36.32
  Bottom 0.254: v13.72,36.32 13.72,31.24 14.48,30.48 v16.76,30.48
N$3  (via drill 0.51)
  Top 0.254: IC5.1 19.72,40.29 v19.3,39.88 | v40.64,11.43 R3.1
  Bottom 0.254: v19.3,39.88 19.3,22.35 25.4,16.26 28.19,16.26 32.26,12.19 39.88,12.19 v40.64,11.43
N$4  (via drill 0.51)
  Top 0.254: IC5.5 17.12,40.28 v17.53,39.88 | v39.12,11.43 R4.1
  Bottom 0.254: v17.53,39.88 18.8,38.61 18.8,22.1 25.15,15.75 27.94,15.75 32.26,11.43 v39.12,11.43
N$5
  Top 0.254: IC2.56 34.29,30.74 33.53,31.5 C12.+ 33.27,32.28
N$6
  Top 0.305: R6.2 16.48,47.75 LED1.C
N$7  (via drill 0.51)
  Top 0.254: v21.08,41.15 20.99,41.24 20.99,43.69
  Top 0.305: R5.1 20.99,43.69 20.99,44.37 C7.2
  Bottom 0.254: JP3.1 22.35,39.88 v21.08,41.15
N$8
  Top 0.254: JP5.5 35.31,49.53 35.31,46.23 38.1,43.43 JP6.2
N$11
  Top 0.254: 16.51,46.23 16.34,46.06 R7.2 16.6,46.23 17.02,46.23 18.32,47.53 19.05,47.53 LED2.C
N$12  (via drill 0.51)
  Top 0.254: v16.51,36.32 16.47,36.28 IC5.23 | R6.1 13.72,47.75 v12.7,46.74
  Bottom 0.254: v12.7,46.74 14.22,45.21 14.22,38.61 v16.51,36.32
N$15
  Top 0.305: R9.2 16.51,2.76 LED3.A
N$16
  Top 0.254: S1.3 5.33,46.86 5.42,46.86 | 5.42,46.86 S1.4 | R10.1 R8.1 5.42,46.86
N$17
  Top 0.254: T1.C R11.1
N$18
  Top 0.254: LED4.C 62.48,42.67 61.47,41.66 61.47,39.54 R11.2
N$19
  Top 0.254: C13.1 45.47,12.79 45.47,14.22 45.97,14.73 Q1.1 45.47,17.02 45.47,21.59 44.95,22.11 IC2.39
N$20
  Top 0.254: C14.1 45.47,29.88 45.47,28.45 45.97,27.94 Q1.2 45.47,25.65 45.47,23.11 44.96,22.61 IC2.40
N$21
  Top 0.254: 61.47,35.73 61.56,35.81 | LED5.C 64.99,39.66 65.02,39.62 64.01,39.62 61.47,37.08 61.47,35.73 | R12.2 61.47,35.73
N$22
  Top 0.254: IC2.47 40.59,26.11 41.15,26.67 41.15,34.8 Q2.1 39.71,36.92 C15.1
N$23
  Top 0.254: Q2.2 39.71,33.69 C16.1 39.74,32.23 IC2.48
N$24
  Top 0.254: T2.C R12.1
N$26
  Top 0.254: T1.B 52.93,40.32 R13.1
N$27
  Top 0.254: T2.B 52.93,36.51 R14.1
N$32  (via drill 0.51)
  Top 0.254: IC5.22 15.82,35.74 15.24,36.32 15.24,37.34 13.97,38.61 v13.21,38.61 | R7.1 14.73,45.89 14.73,45.72 v11.18,45.72
  Bottom 0.254: v13.21,38.61 11.18,40.64 v11.18,45.72
OC1/RD0  (via drill 0.51)
  Top 0.254: v37.85,23.88 37.85,24.89 38.56,25.61 IC2.46
  Bottom 0.254: JP7.7 54.61,49.53 54.61,40.89 37.85,24.13 v37.85,23.88
OC2/RD1  (via drill 0.51)
  Top 0.254: v38.61,29.46 38.1,29.46 37.79,29.15 IC2.49 | JP7.11 49.53,49.53 47.75,49.53 46.99,48.77 46.99,47.5 v48.01,46.48
  Bottom 0.254: v48.01,46.48 48.01,37.34 40.13,29.46 v38.61,29.46
OC3/RD2  (via drill 0.51)
  Top 0.254: v38.1,30.73 37.29,29.92 IC2.50
  Bottom 0.254: JP7.13 46.99,49.53 46.99,37.08 40.64,30.73 v38.1,30.73
OC4/RD3
  Top 0.254: IC2.51 36.79,39.88 37.29,40.39 38.61,40.39 39.37,41.15 39.37,43.18 37.85,44.7 37.85,49.53 JP5.3
P32_PGC  (via drill 0.51)
  Top 0.254: IC2.17 30.29,16.32 28.96,14.99 v26.92,14.99 | v12.19,14.99 v17.53,14.99
  Bottom 0.254: v17.53,14.99 v26.92,14.99 | v12.19,14.99 6.35,14.99 3.81,17.53 ICSP.5
P32_PGD  (via drill 0.51)
  Top 0.254: IC2.18 30.79,15.8 28.96,13.97 v27.69,13.97 | v19.81,13.97 17.53,16.26 v11.94,16.26
  Bottom 0.254: ICSP.4 9.14,16.26 v11.94,16.26 | v19.81,13.97 v27.69,13.97
P32_RST  (via drill 0.51)
  Top 0.254: IC2.7 27.44,23.61 25.91,25.15 25.91,30.73 JP3.2 | v1.78,44.96 R8.2 | v27.43,2.54 25.65,0.76 8.38,0.76 6.86,2.29 v6.86,3.3
  Bottom 0.254: JP3.2 23.62,35.56 23.62,43.18 18.8,47.75 4.57,47.75 v1.78,44.96 3.81,42.93 ICSP.1 5.33,29.21 6.1,28.45 6.1,26.16 5.33,25.4 2.54,25.4 2.03,24.89 2.03,8.13 v6.86,3.3 | v27.43,2.54 JP4.1
PMA8/U2TX/SCL2/CN18/RF5  (via drill 0.51)
  Top 0.254: v38.35,18.8 37.79,18.23 IC2.32
  Bottom 0.254: JP5.14 28.7,45.97 28.7,23.62 33.53,18.8 v38.35,18.8
PMA9/U2RX/SDA2/CN17/RF4  (via drill 0.51)
  Top 0.254: v36.07,19.56 37.29,18.34 IC2.31
  Bottom 0.254: JP5.12 29.21,48.01 29.21,23.88 33.53,19.56 v36.07,19.56
PMD0/RE0  (via drill 0.51)
  Top 0.254: JP7.2 58.17,42.93 52.83,42.93 49.78,39.88 v44.7,39.88 | v32.77,39.37 32.29,38.89 IC2.60
  Bottom 0.254: v44.7,39.88 33.27,39.88 v32.77,39.37
PMD1/RE1  (via drill 0.51)
  Top 0.254: JP7.4 56.13,43.43 52.58,43.43 50.29,41.15 v44.7,41.15 | v32.26,40.64 31.79,40.17 IC2.61
  Bottom 0.254: v32.26,40.64 42.16,40.64 42.67,41.15 v44.7,41.15
PMD2/RE2  (via drill 0.51)
  Top 0.254: JP7.6 54.1,43.94 45.47,43.94 v44.7,43.18 | IC2.62 31.29,41.19 v32,41.91
  Bottom 0.254: v44.7,43.18 44.2,43.18 43.69,43.69 33.78,43.69 v32,41.91
PMD3/RE3  (via drill 0.51)
  Top 0.254: IC2.63 30.79,27.63 31.24,27.18 32,27.18 33.78,25.4 v33.78,23.88
  Bottom 0.254: v33.78,23.88 36.07,23.88 37.08,22.86 38.35,22.86 39.12,23.62 39.12,24.64 55.88,41.4 JP7.8
PMD4/RE4  (via drill 0.51)
  Top 0.254: IC2.64 30.29,27.37 30.99,26.67 31.75,26.67 32.26,26.16 v32.26,24.89
  Bottom 0.254: JP7.10 53.34,40.39 37.85,24.89 v32.26,24.89
PMD5/RE5  (via drill 0.51)
  Top 0.254: IC2.1 28.34,32.4 30.73,34.8 30.73,42.16 v31.5,42.93 | v44.7,44.45 45.21,44.96 49.02,44.96 50.8,46.74 JP7.12
  Bottom 0.254: v31.5,42.93 32.77,44.2 43.69,44.2 43.94,44.45 v44.7,44.45
PMD6/RE6  (via drill 0.51)
  Top 0.254: v31.24,25.65 30.79,26.11 IC2.2
  Bottom 0.254: JP7.14 49.02,47.5 49.02,37.59 38.23,26.8 32.38,26.8 v31.24,25.65
PMD7/RE7
  Top 0.254: JP7.16 46.99,49.53 46.99,51.82 45.97,52.83 31.5,52.83 30.23,51.56 30.23,35.05 26.92,31.75 26.92,25.91 27.22,25.61 IC2.3
PMRD/CN14/RD5  (via drill 0.51)
  Top 0.254: v34.8,45.47 34.29,44.96 34.29,41.4 35.79,39.91 IC2.53
  Bottom 0.254: v34.8,45.47 40.39,45.47 41.66,46.74 JP5.2
PMWR/OC5/IC5/CN13/RD4
  Top 0.254: JP6.1 35.56,40.89 36.29,40.17 IC2.52
RF0  (via drill 0.51)
  Top 0.254: R14.2 51.65,34.71 48.77,37.59 v46.23,37.59 | v33.27,30.23 33.29,30.21 IC2.58
  Bottom 0.254: v46.23,37.59 46.23,37.08 40.89,31.75 34.8,31.75 v33.27,30.23
RF1  (via drill 0.51)
  Top 0.254: IC2.59 32.79,27.67 v34.54,25.91
  Bottom 0.254: JP7.9 52.07,49.53 52.07,39.88 38.1,25.91 v34.54,25.91
RI
  Top 0.254: JP2.4 27.18,34.29 28.45,35.56 28.45,41.66 26.92,43.18 25.65,43.18 24.89,42.42 24.89,40.64 24.13,39.88 20.83,39.88 19.81,38.86 16.76,38.86 16.47,39.16 IC5.6
SCK2/RG6  (via drill 0.51)
  Top 0.254: JP5.11 27.69,49.53 27.69,44.2 29.72,42.16 29.72,35.31 26.42,32 26.42,25.65 26.96,25.11 IC2.4 30.26,25.11 v30.99,24.38 | 51.56,38.52 R13.2 | v60.45,40.89 59.94,41.4 52.07,41.4 51.56,40.89 51.56,38.52 | 51.56,38.52 44.79,38.52 v44.7,38.61
  Bottom 0.254: JP11.3 63.75,27.94 64.77,28.96 64.77,31.24 60.45,35.56 v60.45,40.89 | v44.7,38.61 44.2,38.61 43.18,37.59 43.18,34.8 40.64,32.26 32.77,32.26 30.23,29.72 30.23,25.15 v30.99,24.38
SCL1/RG2
  Top 0.254: IC2.37 40.87,21.11 42.16,19.81 42.16,11.94 43.18,10.92 58.67,10.92 62.99,15.24 64.77,15.24 JP10.3
SDA1/RG3
  Top 0.254: IC2.36 40.6,20.61 41.66,19.56 41.66,11.68 42.93,10.41 59.94,10.41 JP9.3
SDI2/RG7  (via drill 0.51)
  Top 0.254: IC2.5 29.49,24.61 30.73,23.37 v32,23.37 | v49.78,33.78 49.78,32.77 JP12.1
  Bottom 0.254: JP12.1 53.34,29.21 53.34,26.67 JP13.3 | v32,23.37 33.02,23.37 34.04,22.35 38.61,22.35 39.62,23.37 39.62,24.38 49.02,33.78 v49.78,33.78
SDO2/RG8  (via drill 0.51)
  Top 0.254: JP12.3 53.34,26.67 53.34,29.21 JP13.1 51.31,33.78 v51.05,33.78 | IC2.6 29.23,24.11 31.5,21.84 v33.27,21.84
  Bottom 0.254: v33.27,21.84 38.86,21.84 40.13,23.11 40.13,24.13 48.77,32.77 50.04,32.77 v51.05,33.78
SS2/RG9  (via drill 0.51)
  Top 0.254: v44.7,37.34 48.77,33.27 v48.77,31.5 48.77,25.65 50.8,23.62 61.72,23.62 JP11.5 | IC2.8 29.47,23.11 31.75,20.83 v34.29,20.83
  Bottom 0.254: v44.7,37.34 46.23,38.86 46.23,41.66 45.72,42.16 40.89,42.16 JP6.3 | v34.29,20.83 35.05,20.83 35.56,21.34 39.12,21.34 40.64,22.86 40.64,23.88 48.26,31.5 v48.77,31.5
U1RTS/BCLK1/SCK1/INT0/RF6  (via drill 0.51)
  Top 0.254: v37.85,19.81 38.14,20.11 IC2.35
  Bottom 0.254: JP5.10 29.72,46.48 29.72,24.13 33.78,20.07 35.05,20.07 35.56,20.57 37.08,20.57 v37.85,19.81
U1RX/SDI1/RF2  (via drill 0.51)
  Top 0.254: IC2.34 40.59,19.61 40.89,19.3 v40.89,18.29 40.89,14.73 40.64,14.48 R3.2
  Bottom 0.254: JP7.1 62.23,49.53 62.23,47.75 56.9,42.42 56.9,37.59 40.89,21.59 v40.89,18.29
U1TX/SDO1/RF3  (via drill 0.51)
  Top 0.254: IC2.33 39.62,19.11 v39.62,18.29 39.12,17.78 R4.2
  Bottom 0.254: JP7.3 59.69,49.53 59.69,47.5 56.39,44.2 56.39,37.85 39.62,21.08 v39.62,18.29
USB_5V0
  Top 0.762: F1.1 18.38,10.07 19.81,8.64 JP1.1
VREF+/AN0  (via drill 0.51)
  Top 0.254: v28.19,18.29 28.19,19.11 IC2.16
  Bottom 0.254: JP5.15 25.15,49.53 25.15,47.5 28.19,44.45 28.19,27.18 24.38,23.37 24.38,20.32 25.91,18.8 27.69,18.8 v28.19,18.29
VREF-/AN1  (via drill 0.51)
  Top 0.254: v25.91,18.03 27.48,19.61 IC2.15
  Bottom 0.254: JP5.16 23.88,46.99 27.69,43.18 27.69,27.43 23.88,23.62 23.88,20.07 v25.91,18.03
VUSB  (via drill 0.51)
  Top 0.254: R1.1 20.15,32.17 19.81,32.51 17.27,32.51 v17.02,32.26 | v9.4,40.89 9.4,39.88 9.14,39.62 8.26,39.62 USB1.VUSB
  Top 0.508: USB1.VUSB 8.18,39.83 8.13,39.88
  Top 0.762: 8.13,39.88 6.35,39.88 3.81,37.34 3.81,35.31 4.57,34.54 4.57,32.26 3.81,31.5 2.03,31.5 1.02,30.48 1.02,12.95 2.03,11.94 16.34,11.94 F1.2
  Bottom 0.254: v17.02,32.26 17.02,33.53 14.73,35.81 14.73,36.83 13.97,37.59 12.7,37.59 v9.4,40.89

### Text on the board
tNames: RESET | TX | RX | A | G | 13 | 12 | 11 | 10 | 9 | 8 | 7 | 6 | 5 | 4 | 3 | 2 | 1 | 0 | ~ | ~ | ~ | ~ | ~ | 41 | 40 | 39 | 38 | 37 | 36 | 35 | 34 | 33 | 32 | 31 | PWM | ~ | 30 | 29 | 28 | 27 | DIGITAL | 26 | 1 | !CTS | EN | RST | !DSR | RD4 | 10 | RG9 | !DCD | !RI | MASTER | SPI | NC | VPP | SELECT | MISO | SPI | MISO | 3V3 | SCK | GND | GND | SLAVE | !SS | PGD | PGC | A5 | A4 | RG2 | RG3 | ANALOG | PICqueño32 v1a | A6 | A7 | A8 | A9 | A10 | A11 | POWER | A0 | A1 | A2 | A3 | A4 | A5 | POWER | SELECT | USB | EXT | RESET | 3V3 | 5V0 | GND | GND | VIN | 6-9V External | PWR
bNames: Compatible with | chipKIT UNO32 from Digilent | (CC BY-SA) | VPP | 3V3 | GND | PGD | PGC